# EAGLE schematic circuit (EAGLE 9.5.2)
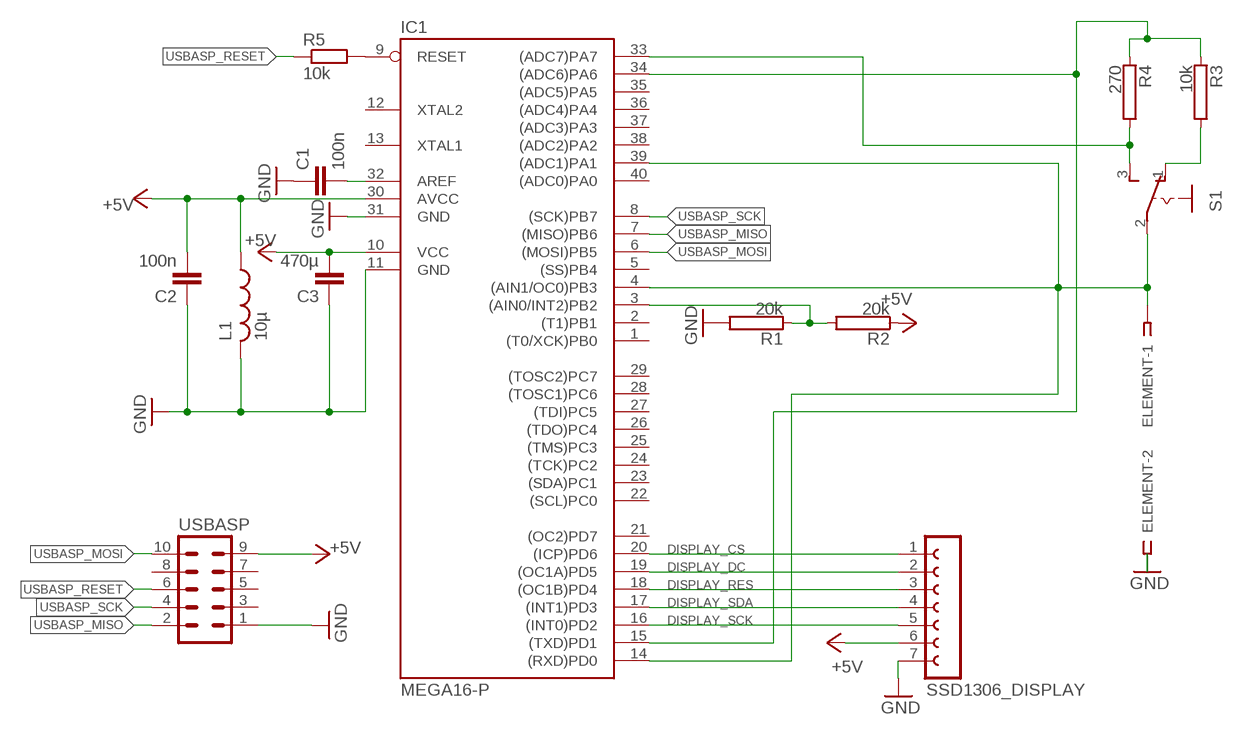
[diagram p0: schematic, sheet 1]

## Parts
C1  100n  C5/2.5  [C5B2.5]
C2  100n  C5/2.5  [C5B2.5]
C3  470µ  C5/2.5  [C5B2.5]
ELEMENT  SSW-101-02-G-Q  [SSW-101-02-G-Q]
IC1  MEGA16-P  [DIL40]
L1  10µ  L-US0204/7  [0204/7]
R1  20k  RAC01  [AC01]
R2  20k  RAC01  [AC01]
R3  10k  RAC01  [AC01]
R4  270  RAC01  [AC01]
R5  10k  R-EU_0204/5  [0204/5]
S1  255SB  [255SB]
SSD1306_DISPLAY  FE07W  [FE07W]
USBASP  MA05-2  [MA05-2]

## Nets
+5V: C2.2 C3.2 IC1.10(VCC) IC1.30(AVCC) L1.1 R1.2 R2.1 SSD1306_DISPLAY.6 USBASP.9 ; supply symbol labelled GND
DISPLAY_CS: IC1.20((ICP)PD6) SSD1306_DISPLAY.1
DISPLAY_DC: IC1.19((OC1A)PD5) SSD1306_DISPLAY.2
DISPLAY_RES: IC1.18((OC1B)PD4) SSD1306_DISPLAY.3
DISPLAY_SCK: IC1.16((INT0)PD2) SSD1306_DISPLAY.5
DISPLAY_SDA: IC1.17((INT1)PD3) SSD1306_DISPLAY.4
GND: C1.1 C2.1 C3.1 ELEMENT.2 IC1.11(GND) IC1.31(GND) L1.2 SSD1306_DISPLAY.7 USBASP.1
N$1: IC1.3((AIN0/INT2)PB2) R1.1 R2.2
N$2: R3.2 S1.1(O)
N$3: IC1.33((ADC7)PA7) R4.2 S1.3(S)
N$4: IC1.15((TXD)PD1) IC1.34((ADC6)PA6) R3.1 R4.1
N$5: IC1.9(RESET) R5.2
N$6: C1.2 IC1.32(AREF)
N$8: ELEMENT.1 IC1.4((AIN1/OC0)PB3) IC1.14((RXD)PD0) IC1.39((ADC1)PA1) S1.2(P)
USBASP_MISO: IC1.7((MISO)PB6) USBASP.2
USBASP_MOSI: IC1.6((MOSI)PB5) USBASP.10
USBASP_RESET: R5.1 USBASP.6
USBASP_SCK: IC1.8((SCK)PB7) USBASP.4
Unconnected: IC1.1((T0/XCK)PB0) IC1.2((T1)PB1) IC1.5((SS)PB4) IC1.12(XTAL2) IC1.13(XTAL1) IC1.21((OC2)PD7) IC1.22((SCL)PC0) IC1.23((SDA)PC1) IC1.24((TCK)PC2) IC1.25((TMS)PC3) IC1.26((TDO)PC4) IC1.27((TDI)PC5) IC1.28((TOSC1)PC6) IC1.29((TOSC2)PC7) IC1.35((ADC5)PA5) IC1.36((ADC4)PA4) IC1.37((ADC3)PA3) IC1.38((ADC2)PA2) IC1.40((ADC0)PA0) USBASP.3 USBASP.5 USBASP.7 USBASP.8

## Library data of the parts
C1-C3 = capacitor-wima:C: CAPACITOR naming: grid - package width
ELEMENT = con-samtec:SSW-101-02-G: THROUGH-HOLE .025" SQ POST SOCKET Source: Samtec SSW.pdf; MF: Samtec Inc.; MPN: SSW-101-02-G-Q
IC1 = atmel:MEGA16-P: MICROCONTROLLER 16 Kbytes FLASH 1 kbytes SRAM 512 bytes EEPROM USART 8-channel 10 bit ADC Source: avr.lbr; MPN: ATMEGA16-16PU; OC_FARNELL: 9171142; OC_NEWARK: 01M6885
L1 = rcl:L-US: INDUCTOR, American symbol; SPICEPREFIX: L
R1-R4 = resistor-power:R: Power Resitor; OC_FARNELL: unknown; OC_NEWARK: unknown
R5 = rcl:R-EU_: RESISTOR, European symbol; SPICEPREFIX: R
S1 = switch:255SB: SLIDING SWITCH Distributor Buerklin, 11G810
SSD1306_DISPLAY = con-lsta:FE07W: FEMALE HEADER; OC_FARNELL: unknown; OC_NEWARK: unknown
USBASP = con-lstb:MA05-2: PIN HEADER; OC_FARNELL: unknown; OC_NEWARK: unknown